# Altium schematic sheet Driver.SchDoc
size A4
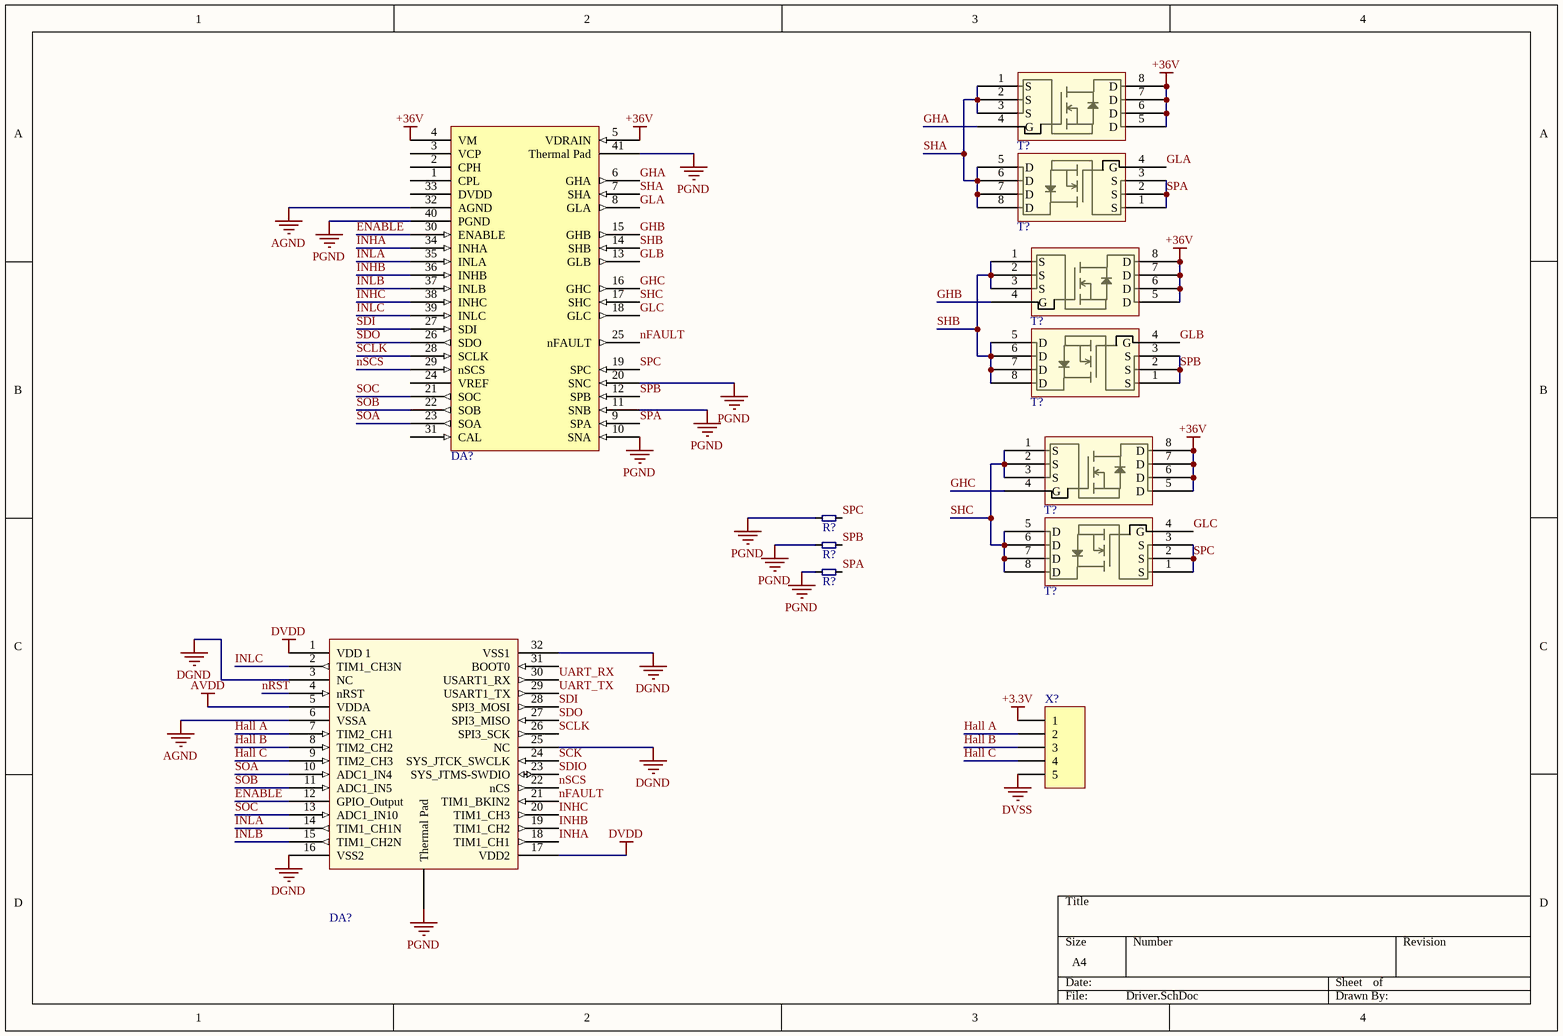
[diagram p0: Driver.SchDoc]

## Parts
(Parts that share a designator on the sheet are numbered #1, #2 ... from top to bottom, then left to right.)
DA?#1  *  [DRV8323S]  (value not drawn)
DA?#2  *  [STM32F301K6Ux]  (value not drawn)
R?#1  CRE2512-FZ-R003E-3  [CRE2512-FZ-R003E-3]  (value not drawn)
R?#2  CRE2512-FZ-R003E-3  [CRE2512-FZ-R003E-3]  (value not drawn)
R?#3  CRE2512-FZ-R003E-3  [CRE2512-FZ-R003E-3]  (value not drawn)
T?#1  *  [CSD18540Q5B]  (value not drawn)
T?#2  *  [CSD18540Q5B]  (value not drawn)
T?#3  *  [CSD18540Q5B]  (value not drawn)
T?#4  *  [CSD18540Q5B]  (value not drawn)
T?#5  *  [CSD18540Q5B]  (value not drawn)
T?#6  *  [CSD18540Q5B]  (value not drawn)
X?  (no value)  [HDR1X5]

## Nets
+3.3V: X?.1
+36V: DA?#1.4(VM) DA?#1.5(VDRAIN) T?#1.5(D) T?#1.6(D) T?#1.7(D) T?#1.8(D) T?#3.5(D) T?#3.6(D) T?#3.7(D) T?#3.8(D) T?#5.5(D) T?#5.6(D) T?#5.7(D) T?#5.8(D)
AGND: DA?#1.32(AGND) DA?#2.6(VSSA)
AVDD: DA?#2.5(VDDA)
DGND: DA?#2.3(NC) DA?#2.16(VSS2) DA?#2.25(NC) DA?#2.32(VSS1)
DVDD: DA?#2.1(VDD_1) DA?#2.17(VDD2)
DVSS: X?.5
PGND: DA?#1.10(SNA) DA?#1.11(SNB) DA?#1.20(SNC) DA?#1.40(PGND) DA?#1.41(Thermal_Pad) DA?#2.33(Thermal_Pad) R?#1.1 R?#2.1 R?#3.1
ENABLE: DA?#1.30(ENABLE) DA?#2.12(GPIO_Output)
GHA: DA?#1.6(GHA) T?#1.4(G)
GHB: DA?#1.15(GHB) T?#3.4(G)
GHC: DA?#1.16(GHC) T?#5.4(G)
GLA: DA?#1.8(GLA) T?#2.4(G)
GLB: DA?#1.13(GLB) T?#4.4(G)
GLC: DA?#1.18(GLC) T?#6.4(G)
Hall A: DA?#2.7(TIM2_CH1) X?.2
Hall B: DA?#2.8(TIM2_CH2) X?.3
Hall C: DA?#2.9(TIM2_CH3) X?.4
INHA: DA?#1.34(INHA) DA?#2.18(TIM1_CH1)
INHB: DA?#1.36(INHB) DA?#2.19(TIM1_CH2)
INHC: DA?#1.38(INHC) DA?#2.20(TIM1_CH3)
INLA: DA?#1.35(INLA) DA?#2.14(TIM1_CH1N)
INLB: DA?#1.37(INLB) DA?#2.15(TIM1_CH2N)
INLC: DA?#1.39(INLC) DA?#2.2(TIM1_CH3N)
nFAULT: DA?#1.25(nFAULT) DA?#2.21(TIM1_BKIN2)
nRST: DA?#2.4(nRST)
nSCS: DA?#1.29(nSCS) DA?#2.22(nCS)
SCK: DA?#2.24(SYS_JTCK_SWCLK)
SCLK: DA?#1.28(SCLK) DA?#2.26(SPI3_SCK)
SDI: DA?#1.27(SDI) DA?#2.28(SPI3_MOSI)
SDIO: DA?#2.23(SYS_JTMS-SWDIO)
SDO: DA?#1.26(SDO) DA?#2.27(SPI3_MISO)
SHA: DA?#1.7(SHA) T?#1.1(S) T?#1.2(S) T?#1.3(S) T?#2.5(D) T?#2.6(D) T?#2.7(D) T?#2.8(D)
SHB: DA?#1.14(SHB) T?#3.1(S) T?#3.2(S) T?#3.3(S) T?#4.5(D) T?#4.6(D) T?#4.7(D) T?#4.8(D)
SHC: DA?#1.17(SHC) T?#5.1(S) T?#5.2(S) T?#5.3(S) T?#6.5(D) T?#6.6(D) T?#6.7(D) T?#6.8(D)
SOA: DA?#1.23(SOA) DA?#2.10(ADC1_IN4)
SOB: DA?#1.22(SOB) DA?#2.11(ADC1_IN5)
SOC: DA?#1.21(SOC) DA?#2.13(ADC1_IN10)
SPA: DA?#1.9(SPA) R?#3.2 T?#2.1(S) T?#2.2(S) T?#2.3(S)
SPB: DA?#1.12(SPB) R?#2.2 T?#4.1(S) T?#4.2(S) T?#4.3(S)
SPC: DA?#1.19(SPC) R?#1.2 T?#6.1(S) T?#6.2(S) T?#6.3(S)
UART_RX: DA?#2.30(USART1_RX)
UART_TX: DA?#2.29(USART1_TX)

Not connected (* = marked no-connect by the designer): DA?#1 1(CPL) 2(CPH) 3(VCP) 24(VREF) 31(CAL) 33(DVDD); DA?#2 31(BOOT0)

## Library data of the parts
DA?#1 = DRV8320S
DA?#2 = STM32F301K6Ux
R?#1-R?#3 = Resistor: High Power Current Sense Chip Resistor
T?#1-T?#6 = CSD18540Q5B
X? = Header 5: Header, 5-Pin; LatestRevisionDate: 17-Jul-2002; LatestRevisionNote: Re-released for DXP Platform.; Publisher: Altium Limited